# Altium project Bus_Terminal.PrjPcb
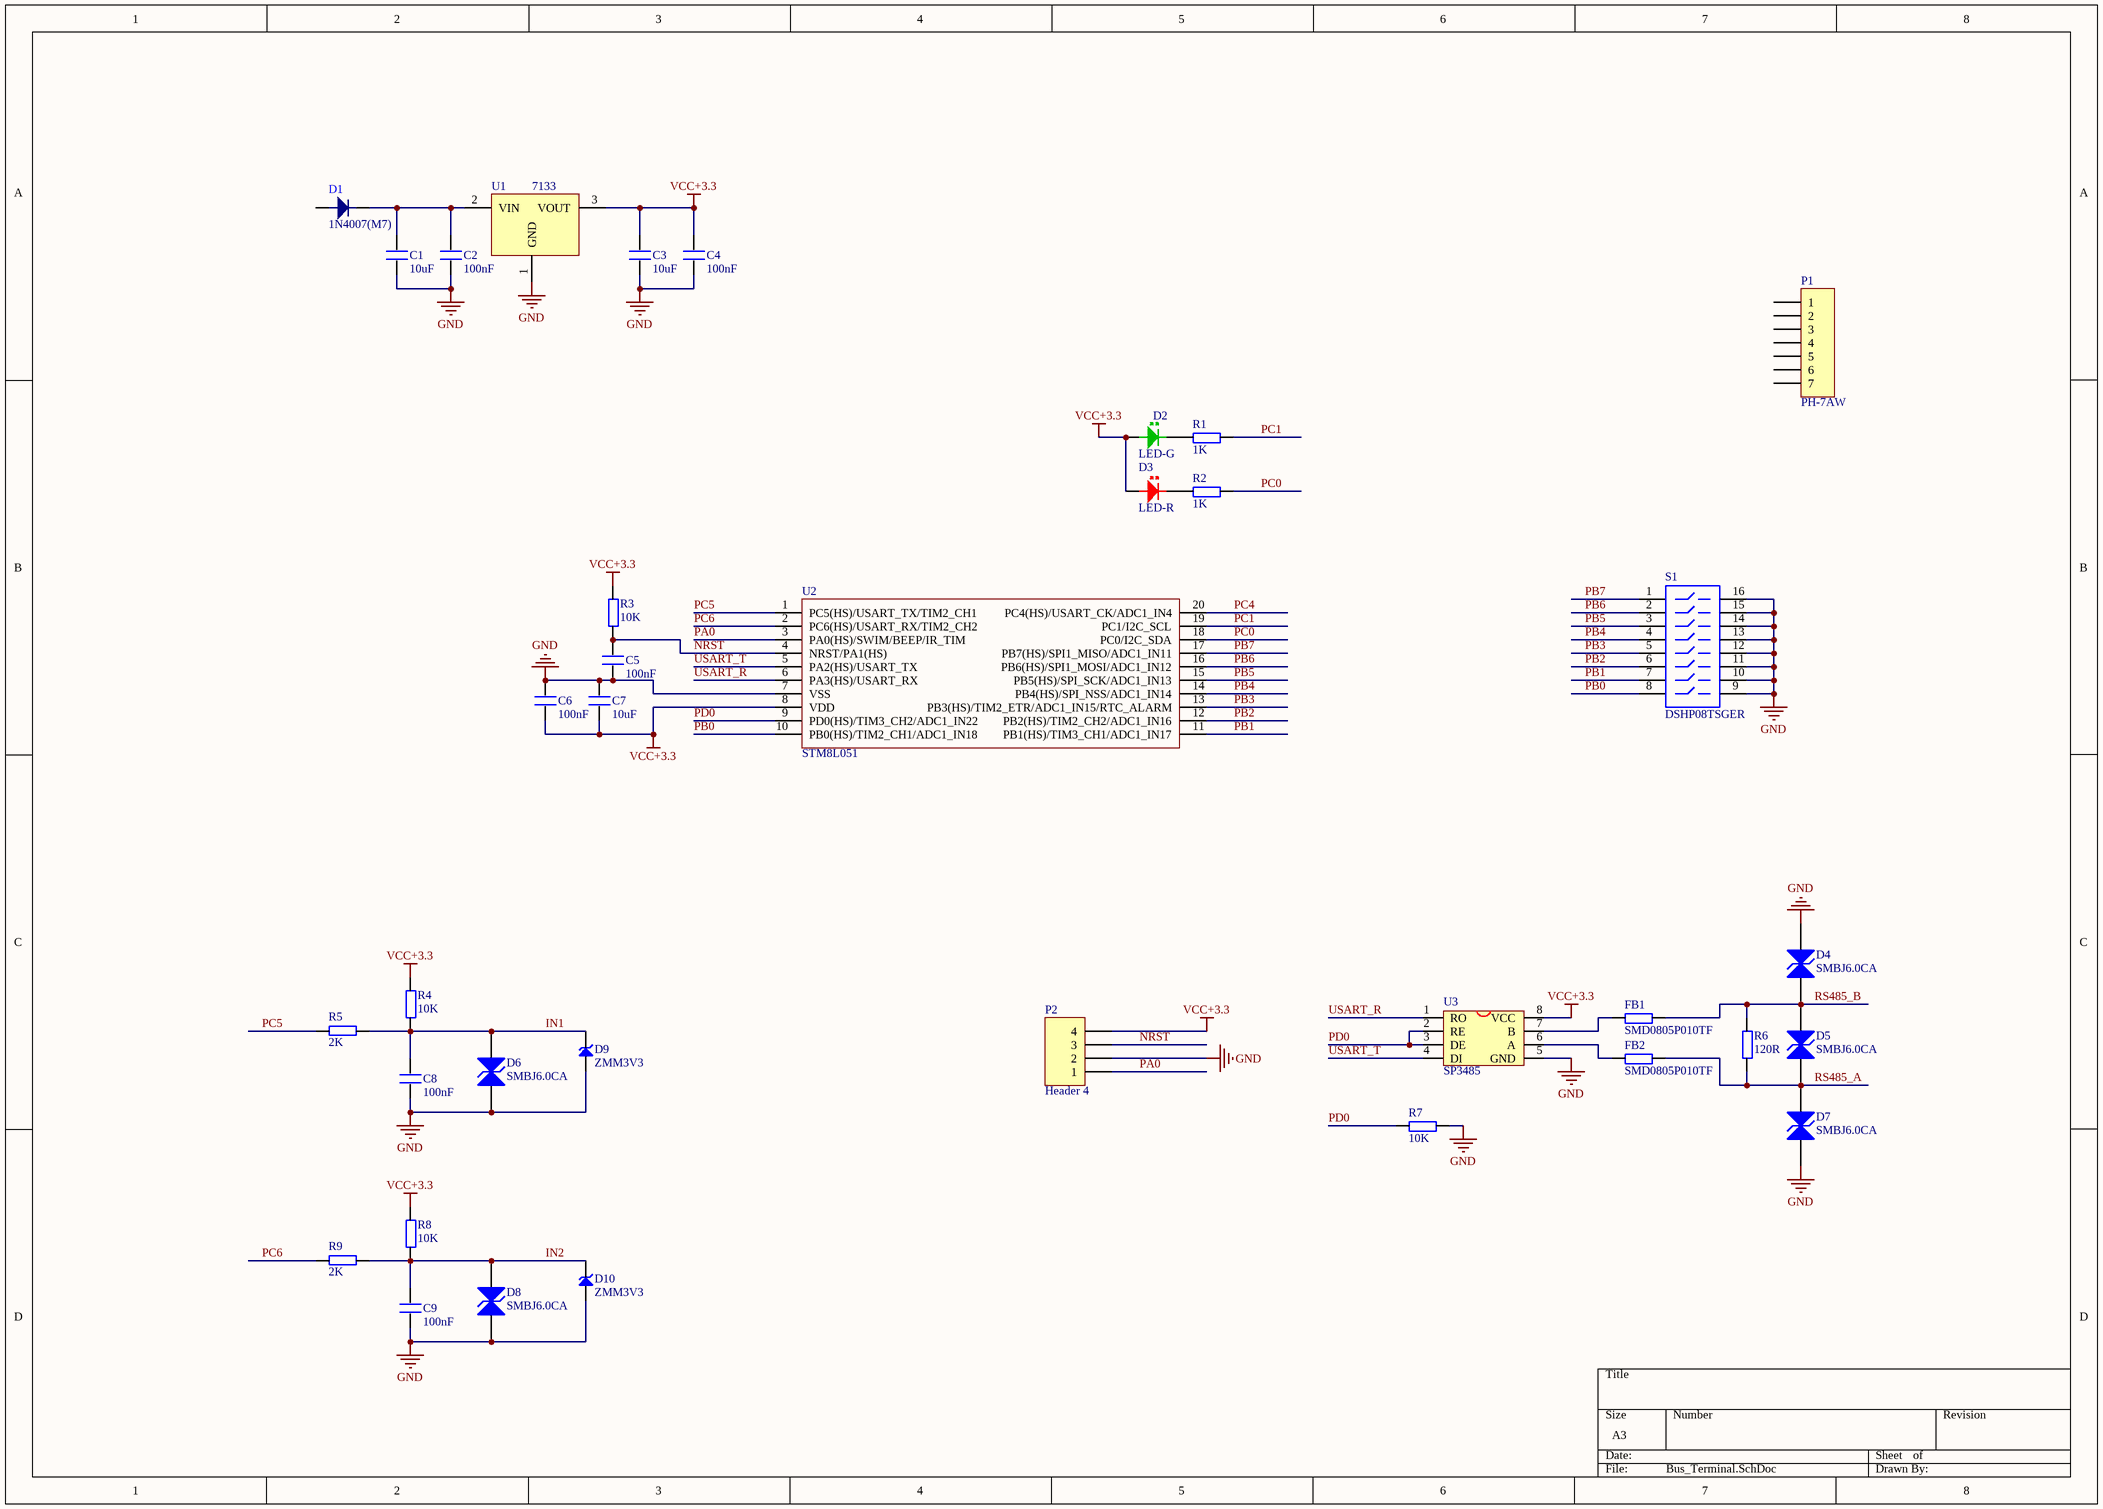
[diagram p0: Bus_Terminal.SchDoc]
1 sheet, 36 parts. Net scope: global (net labels, ports and power ports of the same name join across sheets).
Board file: Bus_Terminal.PcbDoc

## Sheet Bus_Terminal.SchDoc
size A3

### Parts
C1  10uF  [0805-C]
C2  100nF  [0603-C]
C3  10uF  [0805-C]
C4  100nF  [0603-C]
C5  100nF  [0603-C]
C6  100nF  [0603-C]
C7  10uF  [0805-C]
C8  100nF  [0603-C]
C9  100nF  [0603-C]
D1  1N4007(M7)  [DO-214AC(SMA)]
D2  LED-G  [0805-LED]
D3  LED-R  [0805-LED]
D4  SMBJ6.0CA  [SMB-DO-214AA-CA]
D5  SMBJ6.0CA  [SMB-DO-214AA-CA]
D6  SMBJ6.0CA  [SMB-DO-214AA-CA]
D7  SMBJ6.0CA  [SMB-DO-214AA-CA]
D8  SMBJ6.0CA  [SMB-DO-214AA-CA]
D9  ZMM3V3  [DIODE_ZMMx]
D10  ZMM3V3  [DIODE_ZMMx]
FB1  SMD0805P010TF  [0805-R]
FB2  SMD0805P010TF  [0805-R]
P1  PH-7AW  [PH-7AW]
P2  Header 4  [HDR1X4]
R1  1K  [0603-R]
R2  1K  [0603-R]
R3  10K  [0603-R]
R4  10K  [0603-R]
R5  2K  [0603-R]
R6  120R  [0603-R]
R7  10K  [0603-R]
R8  10K  [0603-R]
R9  2K  [0603-R]
S1  DSHP08TSGER  [SOP127P890X230-16N]
U1  7133  [SOT-89]
U2  STM8L051  [TSSOP20]
U3  SP3485  [SOP-8]

### Nets
GND: C1.1 C2.1 C3.1 C4.1 C5.1 C6.2 C7.2 C8.1 C9.1 D4.2 D6.1 D7.1 D8.1 D9.1 D10.1 P2.2 R7.2 S1.9 S1.10 S1.11 S1.12 S1.13 S1.14 S1.15 S1.16 U1.1(GND) U2.7(VSS) U3.5(GND)
VCC+3.3: C3.2 C4.2 C6.1 C7.1 D2.1 D3.1 P2.4 R3.2 R4.2 R8.2 U1.3(VOUT) U2.8(VDD) U3.8(VCC)
IN1: C8.2 D6.2 D9.2 R4.1 R5.1
IN2: C9.2 D8.2 D10.2 R8.1 R9.1
NRST: C5.2 P2.3 R3.1 U2.4(NRST/PA1(HS))
PA0: P2.1 U2.3(PA0(HS)/SWIM/BEEP/IR_TIM)
PB0: S1.8 U2.10(PB0(HS)/TIM2_CH1/ADC1_IN18)
PB1: S1.7 U2.11(PB1(HS)/TIM3_CH1/ADC1_IN17)
PB2: S1.6 U2.12(PB2(HS)/TIM2_CH2/ADC1_IN16)
PB3: S1.5 U2.13(PB3(HS)/TIM2_ETR/ADC1_IN15/RTC_ALARM)
PB4: S1.4 U2.14(PB4(HS)/SPI_NSS/ADC1_IN14)
PB5: S1.3 U2.15(PB5(HS)/SPI_SCK/ADC1_IN13)
PB6: S1.2 U2.16(PB6(HS)/SPI1_MOSI/ADC1_IN12)
PB7: S1.1 U2.17(PB7(HS)/SPI1_MISO/ADC1_IN11)
PC0: R2.2 U2.18(PC0/I2C_SDA)
PC1: R1.2 U2.19(PC1/I2C_SCL)
PC4: U2.20(PC4(HS)/USART_CK/ADC1_IN4)
PC5: R5.2 U2.1(PC5(HS)/USART_TX/TIM2_CH1)
PC6: R9.2 U2.2(PC6(HS)/USART_RX/TIM2_CH2)
PD0: R7.1 U2.9(PD0(HS)/TIM3_CH2/ADC1_IN22) U3.2(RE) U3.3(DE)
RS485_A: D5.1 D7.2 FB2.2 R6.1
RS485_B: D4.1 D5.2 FB1.2 R6.2
USART_R: U2.6(PA3(HS)/USART_RX) U3.1(RO)
USART_T: U2.5(PA2(HS)/USART_TX) U3.4(DI)
NetC1_2: C1.2 C2.2 D1.2 U1.2(VIN)
NetD2_2: D2.2 R1.1
NetD3_2: D3.2 R2.1
NetFB1_1: FB1.1 U3.7(B)
NetFB2_1: FB2.1 U3.6(A)

Not connected (* = marked no-connect by the designer): D1 1; P1 1 2 3 4 5 6 7

### Library data of the parts
C1-C9 = C
D1 = 1N4007: 1A整流二极管
D2 = LED-GRE: 绿色LED
D3 = LED-RED: 红色LED
D4-D8 = SMBJ6.0CA: TVS
D9 D10 = ZMM3V6
FB1 FB2 = Res: 保险丝
P1 = PH-7AW: 连接器
P2 = Header 4: Header, 4-Pin; LatestRevisionDate: 17-Jul-2002; LatestRevisionNote: Re-released for DXP Platform.; Publisher: Altium Limited
R1-R9 = Res
S1 = DSHP08TSGER: 贴片拨码开关
U1 = 7133: LDO
U2 = STM8L051: 单片机
U3 = MAX3485